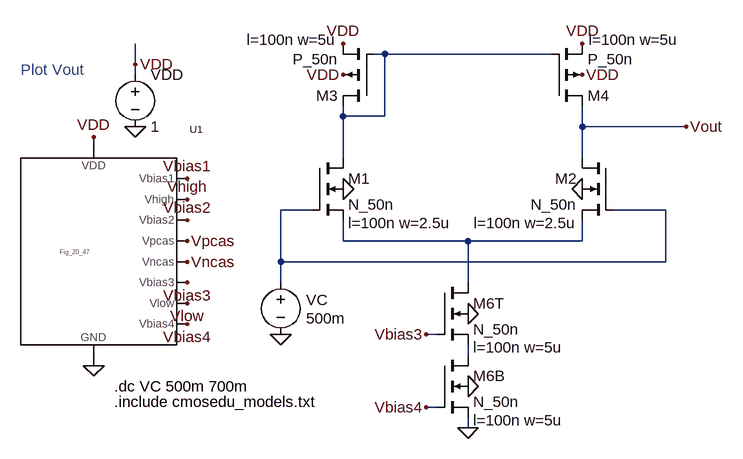
[diagram p0: schematic Fig22_17.asc]
Fig22_17.asc, the LTspice schematic file:
Version 4
SHEET 1 1792 680
WIRE 1248 -368 1232 -368
WIRE 1504 -368 1248 -368
WIRE 864 -352 864 -384
WIRE 864 -336 864 -352
WIRE 1184 -272 1184 -288
WIRE 1248 -272 1248 -368
WIRE 1248 -272 1184 -272
WIRE 1552 -256 1552 -288
WIRE 1712 -256 1552 -256
WIRE 1184 -208 1184 -272
WIRE 1552 -208 1552 -256
WIRE 1136 -128 1088 -128
WIRE 1680 -128 1600 -128
WIRE 1184 -80 1184 -112
WIRE 1376 -80 1184 -80
WIRE 1552 -80 1552 -112
WIRE 1552 -80 1376 -80
WIRE 1088 -48 1088 -128
WIRE 1680 -48 1680 -128
WIRE 1680 -48 1088 -48
WIRE 1088 -16 1088 -48
WIRE 1376 -16 1376 -80
WIRE 1328 64 1312 64
WIRE 1376 96 1376 80
WIRE 1328 176 1312 176
WIRE 1376 208 1376 192
FLAG 864 -256 0
FLAG 864 -352 VDD
FLAG 1552 -160 0
FLAG 1376 208 0
FLAG 1184 -160 0
FLAG 1552 -384 VDD
FLAG 1552 -336 VDD
FLAG 1184 -336 VDD
FLAG 800 -240 VDD
FLAG 800 112 0
FLAG 944 -176 Vbias1
FLAG 944 -144 Vhigh
FLAG 944 -112 Vbias2
FLAG 944 -16 Vbias3
FLAG 944 -80 Vpcas
FLAG 944 -48 Vncas
FLAG 944 48 Vbias4
FLAG 944 16 Vlow
FLAG 1088 64 0
FLAG 1184 -384 VDD
FLAG 1376 32 0
FLAG 1376 144 0
FLAG 1312 64 Vbias3
FLAG 1312 176 Vbias4
FLAG 1712 -256 Vout
SYMBOL voltage 864 -352 R0
WINDOW 123 0 0 Left 2
WINDOW 39 0 0 Left 2
SYMATTR InstName VDD
SYMATTR Value 1
SYMBOL nmos4 1600 -208 M0
WINDOW 123 56 100 Left 2
SYMATTR Value2 l=100n w=2.5u
SYMATTR InstName M2
SYMATTR Value N_50n
SYMBOL nmos4 1136 -208 R0
WINDOW 123 56 100 Left 2
SYMATTR Value2 l=100n w=2.5u
SYMATTR InstName M1
SYMATTR Value N_50n
SYMBOL pmos4 1504 -288 M180
WINDOW 123 58 102 Left 2
WINDOW 0 56 16 Left 2
SYMATTR Value2 l=100n w=5u
SYMATTR InstName M4
SYMATTR Value P_50n
SYMBOL pmos4 1232 -288 R180
WINDOW 123 58 102 Left 2
WINDOW 0 56 16 Left 2
SYMATTR Value2 l=100n w=5u
SYMATTR InstName M3
SYMATTR Value P_50n
SYMBOL Fig_20_47 800 -64 R0
SYMATTR InstName U1
SYMBOL voltage 1088 -32 R0
WINDOW 0 39 43 Left 2
WINDOW 123 38 75 Left 2
WINDOW 39 0 0 Left 2
WINDOW 3 39 71 Left 2
SYMATTR InstName VC
SYMATTR Value 500m
SYMBOL nmos4 1328 -16 R0
WINDOW 123 56 100 Left 2
SYMATTR Value2 l=100n w=5u
SYMATTR InstName M6T
SYMATTR Value N_50n
SYMBOL nmos4 1328 96 R0
WINDOW 123 56 100 Left 2
SYMATTR Value2 l=100n w=5u
SYMATTR InstName M6B
SYMATTR Value N_50n
TEXT 832 168 Left 2 !.include cmosedu_models.txt
TEXT 688 -344 Left 2 ;Plot Vout
TEXT 832 144 Left 2 !.dc VC 500m 700m

The netlist it stands for:
* Fig22_17.asc
VDD VDD 0 1
M2 Vout N002 N003 0 N_50n l=100n w=2.5u
M1 N001 N002 N003 0 N_50n l=100n w=2.5u
M4 Vout N001 VDD VDD P_50n l=100n w=5u
M3 N001 N001 VDD VDD P_50n l=100n w=5u
XU1 Vbias1 Vhigh Vbias2 Vpcas Vncas Vbias3 Vlow Vbias4 VDD 0 Fig_20_47  ; pins Vbias1 Vhigh Vbias2 Vpcas Vncas Vbias3 Vlow Vbias4 VDD GND
VC N002 0 500m
M6T N003 Vbias3 N004 0 N_50n l=100n w=5u
M6B N004 Vbias4 0 0 N_50n l=100n w=5u
.model NMOS NMOS
.model PMOS PMOS
.lib standard.mos
.include cmosedu_models.txt
* Plot Vout
.dc VC 500m 700m
.backanno
.end